# Altium schematic sheet SDIO_SDcard.SchDoc
size A; SheetNumber: 4; SheetTotal: 12
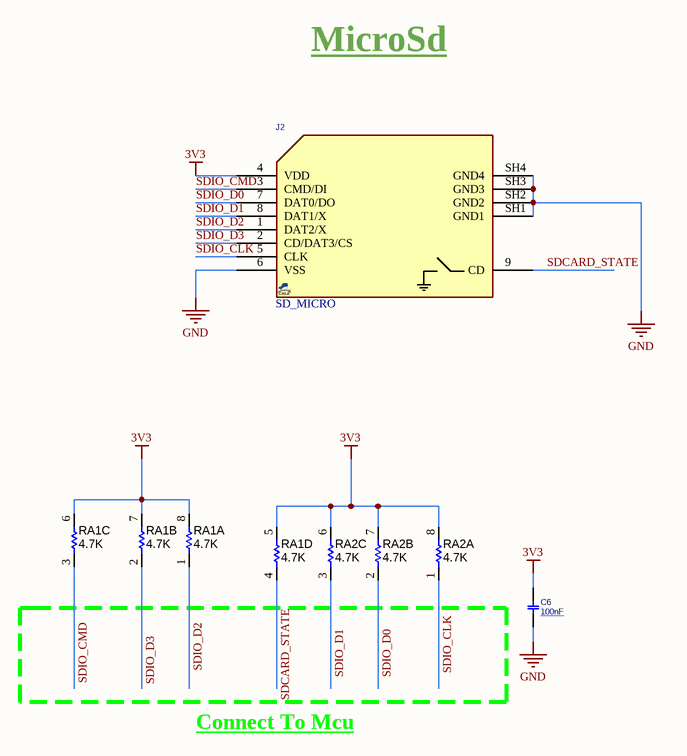
[diagram p0: SDIO_SDcard.SchDoc]

## Parts
C6  100nF  [C0603]
J2  SD_MICRO  [SDMICRO_AT]
RA1  value 4.7K  [RP0603X4]  (hidden comment: Film Res Pack)  (parts A,B,C,D of 4)
RA2  value 4.7K  [RP0603X4]  (hidden comment: Film Res Pack)  (parts A,B,C of 4)

## Nets
3V3: C6.2 J2.4(VDD) RA1.5 RA1.6 RA1.7 RA1.8 RA2.6 RA2.7 RA2.8
GND: C6.1 J2.6(VSS) J2.SH1(GND1) J2.SH2(GND2) J2.SH3(GND3) J2.SH4(GND4)
SDCARD_STATE: J2.9(CD) RA1.4
SDIO_CLK: J2.5(CLK) RA2.1
SDIO_CMD: J2.3(CMD/DI) RA1.3
SDIO_D0: J2.7(DAT0/DO) RA2.2
SDIO_D1: J2.8(DAT1/X) RA2.3
SDIO_D2: J2.1(DAT2/X) RA1.1
SDIO_D3: J2.2(CD/DAT3/CS) RA1.2

## Notes on the sheet
- MicroSd
- Connect To Mcu

## Library data of the parts
C6 = CAP_SMD_MLCC_0603: CAP, MLCC, -F, -V, MATERIAL, -%, 0201; PARAM: -, -%; MANF_P#: MANF_PART#; PRICE: 100= 1$; MANF: -; PARAM2: -V; ASSEMBLY: ASSEMBLY; VALUE: 100nF
J2 = SOCKET_SDMICRO_AT: SD MICRO exist in Iran, Attend 112J-TDAR-R01; PARAM: push-push; MANF: Attend; MANF_P#: 112J-TDAR-R01; VALUE: SD_MICRO
RA1 RA2 = RES_SMD_PACK_X4: RESISTOR, SMD, PACKX4; MANF_P#: MANF_PART#; MANF: MANF